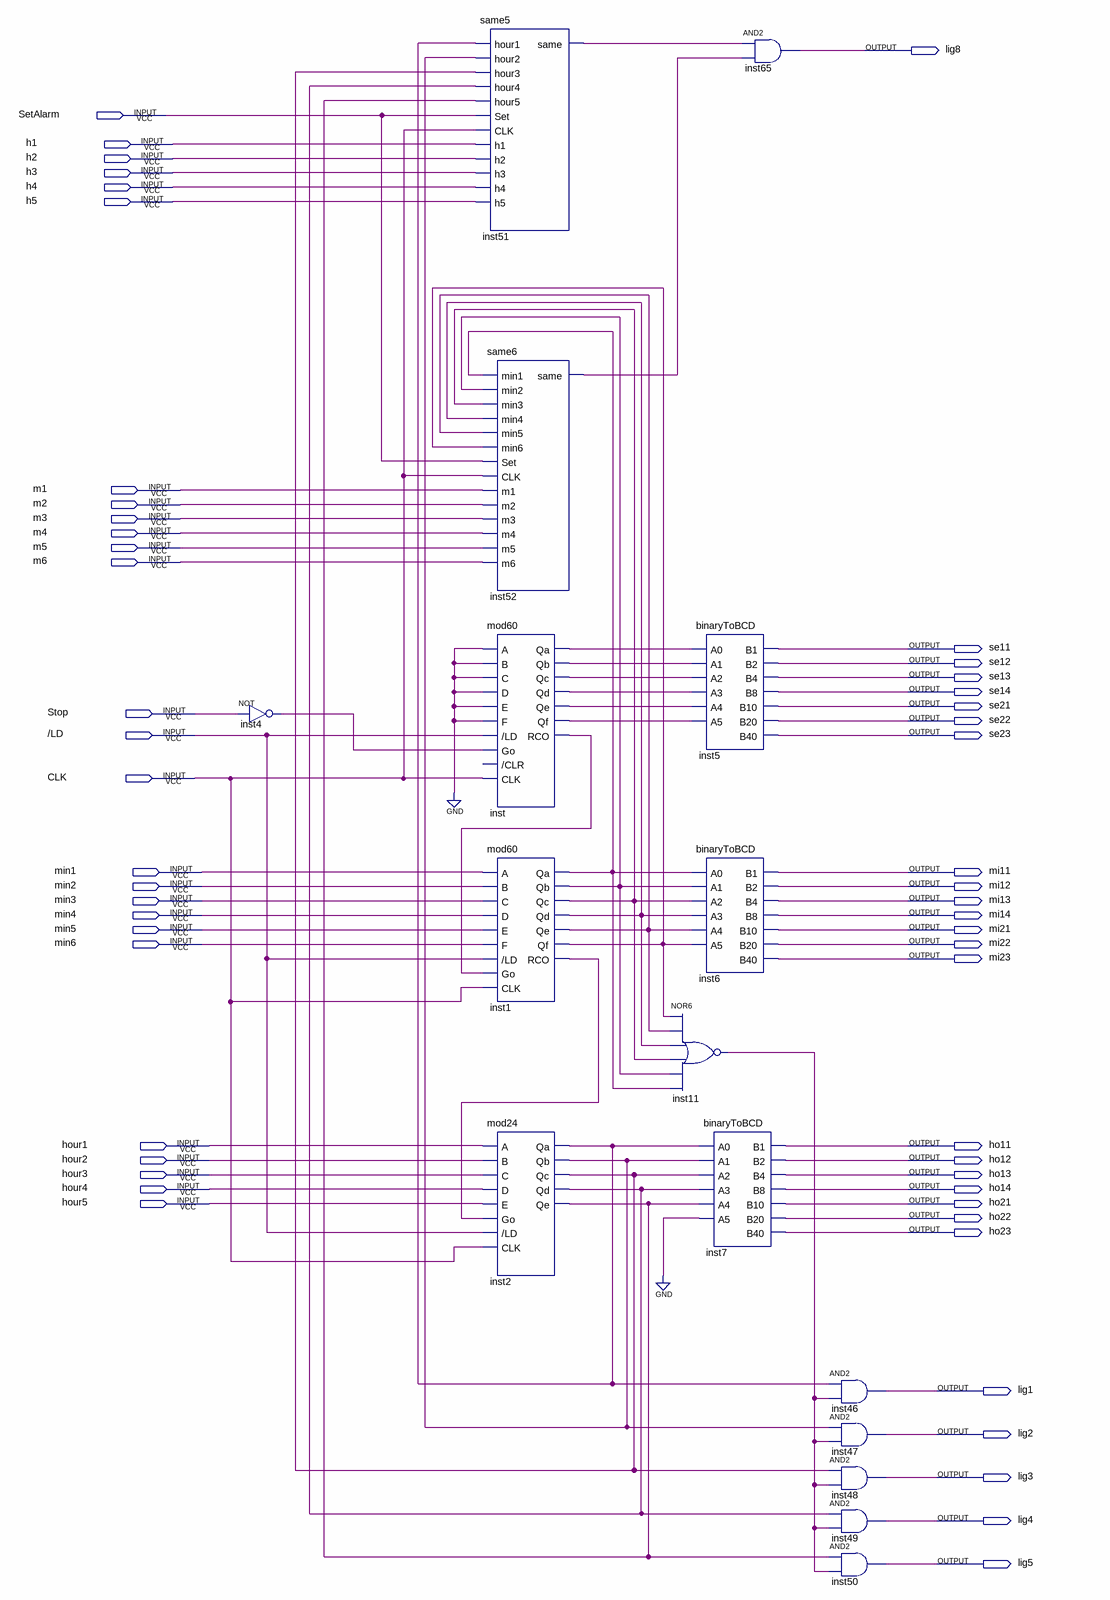
[diagram p0: schematic sheet]
// Quartus schematic first.bdf as structural Verilog: 16 symbols, 53 pins
module first (
  input  SetAlarm,
  input  h1,
  input  h2,
  input  h3,
  input  h4,
  input  h5,
  input  m1,
  input  m2,
  input  m3,
  input  m4,
  input  m5,
  input  m6,
  input  Stop,
  input  \/LD ,
  input  CLK,
  input  min1,
  input  min2,
  input  min3,
  input  min4,
  input  min5,
  input  min6,
  input  hour1,
  input  hour2,
  input  hour3,
  input  hour4,
  input  hour5,
  output lig8,
  output se11,
  output se12,
  output se13,
  output se14,
  output se21,
  output se22,
  output se23,
  output mi11,
  output mi12,
  output mi13,
  output mi14,
  output mi21,
  output mi22,
  output mi23,
  output ho11,
  output ho12,
  output ho13,
  output ho14,
  output ho21,
  output ho22,
  output ho23,
  output lig1,
  output lig2,
  output lig3,
  output lig4,
  output lig5
);

  wire inst1_qa, inst1_qb, inst1_qc, inst1_qd, inst1_qe, inst1_qf, inst1_rco, inst2_qa, inst2_qb, inst2_qc,
       inst2_qd, inst2_qe, inst4_out, inst11_out, inst51_same, inst52_same, inst_qa, inst_qb, inst_qc,
       inst_qd, inst_qe, inst_qf, inst_rco;

  not inst4 (inst4_out, Stop);
  same5 inst51 (
    .hour1(inst2_qa), .hour2(inst2_qb), .hour3(inst2_qc), .hour4(inst2_qd), .hour5(inst2_qe), .Set(SetAlarm),
    .CLK(CLK), .h1(h1), .h2(h2), .h3(h3), .h4(h4), .h5(h5), .same(inst51_same));
  same6 inst52 (
    .min1(inst1_qa), .min2(inst1_qb), .min3(inst1_qc), .min4(inst1_qd), .min5(inst1_qe), .min6(inst1_qf),
    .Set(SetAlarm), .CLK(CLK), .m1(m1), .m2(m2), .m3(m3), .m4(m4), .m5(m5), .m6(m6), .same(inst52_same));
  mod60 inst (
    .A(1'b0), .B(1'b0), .C(1'b0), .D(1'b0), .E(1'b0), .F(1'b0), .\/LD (\/LD ), .Go(inst4_out), .CLK(CLK),
    .Qa(inst_qa), .Qb(inst_qb), .Qc(inst_qc), .Qd(inst_qd), .Qe(inst_qe), .Qf(inst_qf), .RCO(inst_rco));  // open: /CLR
  mod60 inst1 (
    .A(min1), .B(min2), .C(min3), .D(min4), .E(min5), .F(min6), .\/LD (\/LD ), .Go(inst_rco), .CLK(CLK),
    .Qa(inst1_qa), .Qb(inst1_qb), .Qc(inst1_qc), .Qd(inst1_qd), .Qe(inst1_qe), .Qf(inst1_qf), .RCO(inst1_rco));
  mod24 inst2 (
    .A(hour1), .B(hour2), .C(hour3), .D(hour4), .E(hour5), .Go(inst1_rco), .\/LD (\/LD ), .CLK(CLK),
    .Qa(inst2_qa), .Qb(inst2_qb), .Qc(inst2_qc), .Qd(inst2_qd), .Qe(inst2_qe));
  binaryToBCD inst5 (
    .A0(inst_qa), .A1(inst_qb), .A2(inst_qc), .A3(inst_qd), .A4(inst_qe), .A5(inst_qf), .B1(se11), .B2(se12),
    .B4(se13), .B8(se14), .B10(se21), .B20(se22), .B40(se23));
  binaryToBCD inst6 (
    .A0(inst1_qa), .A1(inst1_qb), .A2(inst1_qc), .A3(inst1_qd), .A4(inst1_qe), .A5(inst1_qf), .B1(mi11),
    .B2(mi12), .B4(mi13), .B8(mi14), .B10(mi21), .B20(mi22), .B40(mi23));
  nor inst11 (inst11_out, inst1_qf, inst1_qe, inst1_qd, inst1_qc, inst1_qb, inst1_qa);
  binaryToBCD inst7 (
    .A0(inst2_qa), .A1(inst2_qb), .A2(inst2_qc), .A3(inst2_qd), .A4(inst2_qe), .A5(1'b0), .B1(ho11),
    .B2(ho12), .B4(ho13), .B8(ho14), .B10(ho21), .B20(ho22), .B40(ho23));
  and inst65 (lig8, inst51_same, inst52_same);
  and inst46 (lig1, inst2_qa, inst11_out);
  and inst47 (lig2, inst2_qb, inst11_out);
  and inst48 (lig3, inst2_qc, inst11_out);
  and inst49 (lig4, inst2_qd, inst11_out);
  and inst50 (lig5, inst2_qe, inst11_out);
endmodule
